# Altium schematic sheet top.SchDoc: RadFET Calibration Stand Top Level
size A2; Author: Michał Gumiela
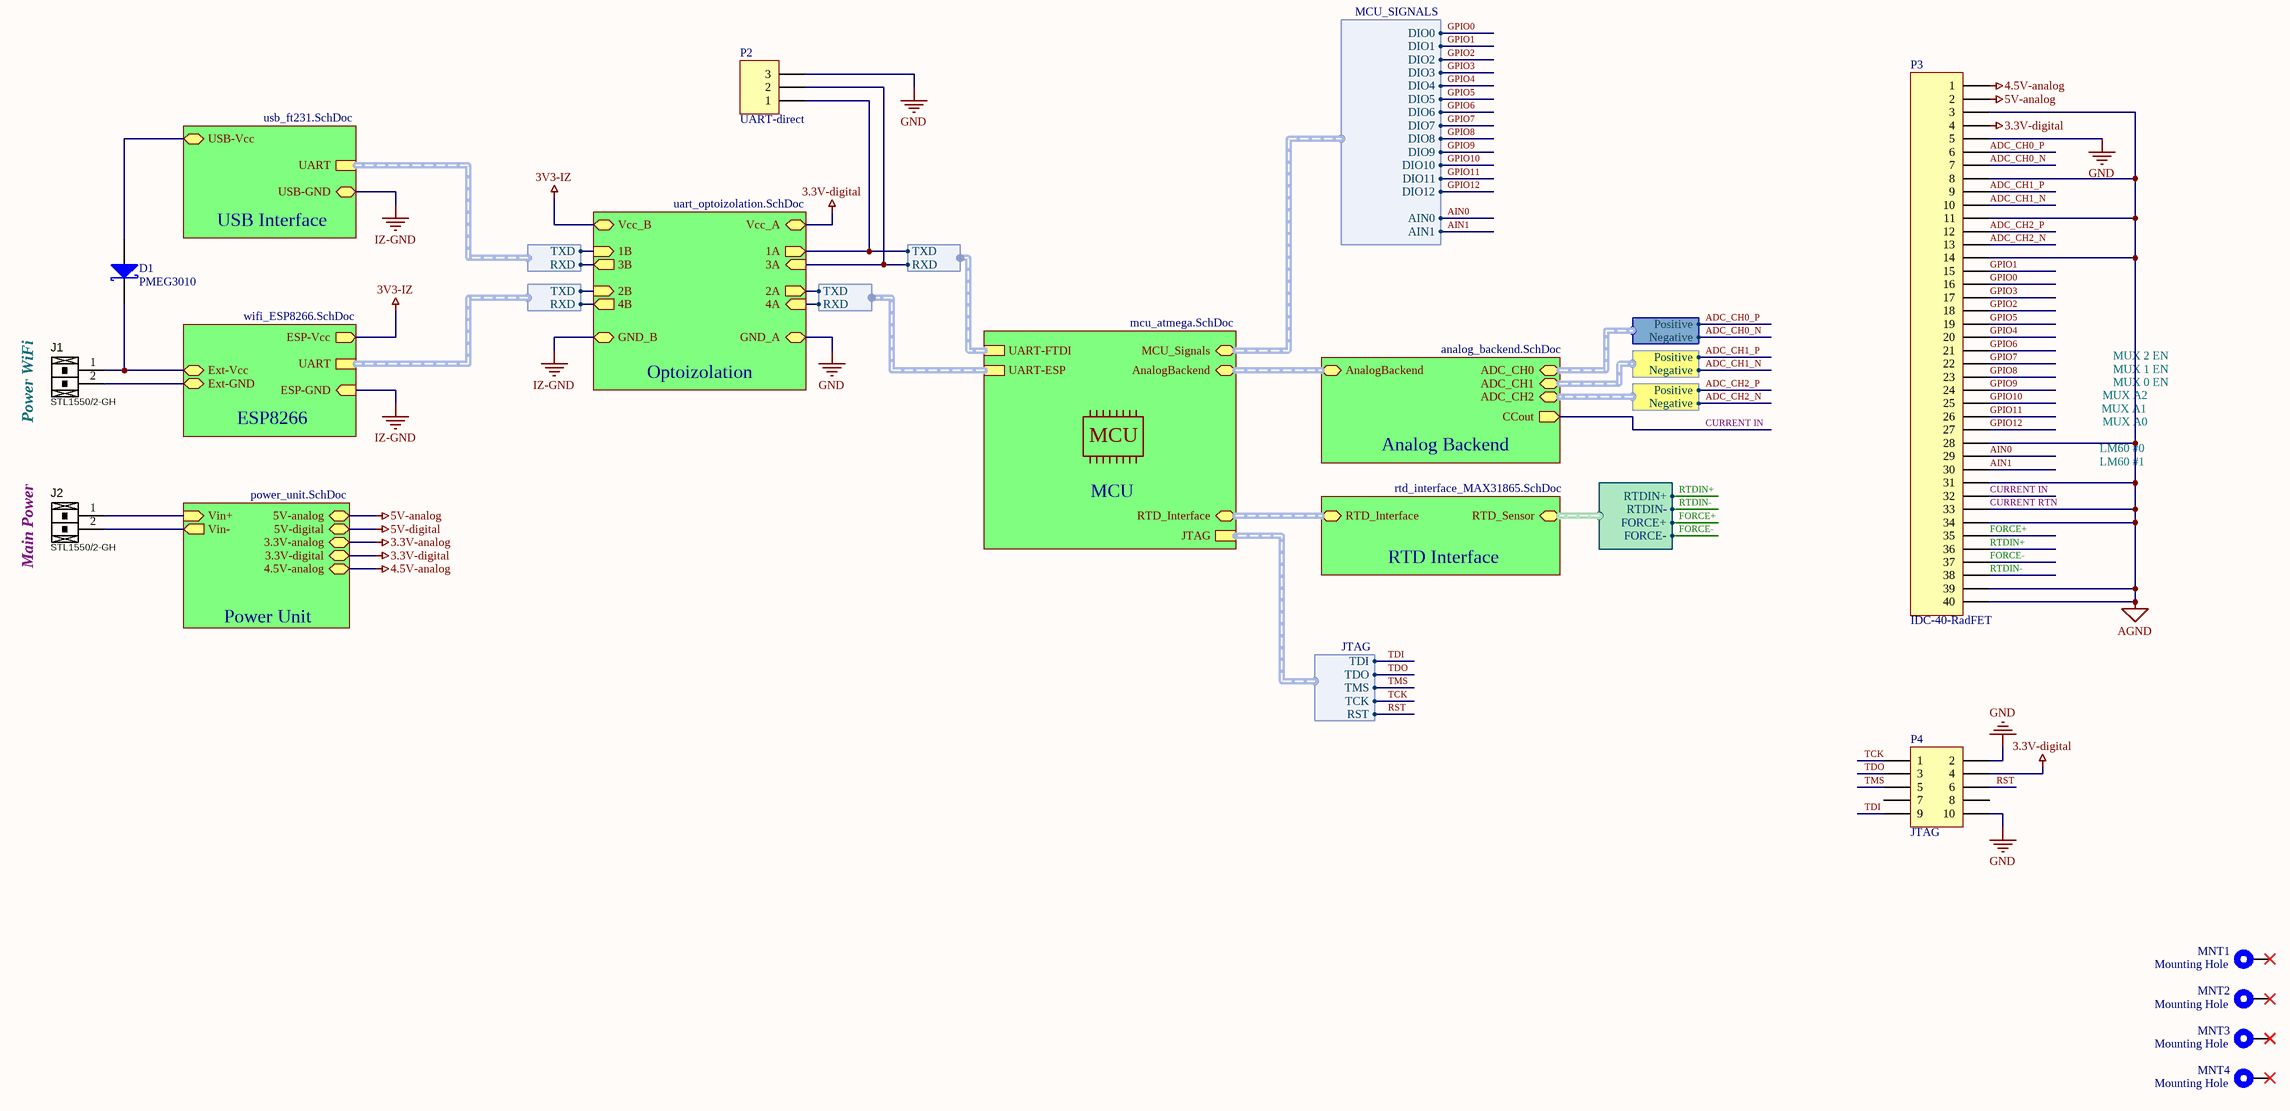
[diagram p0: top.SchDoc]

## Parts
D1  PMEG3010  [SOD-323]
J1  Manufacturer Part Number 1: STL1550/2-GH  [2P_PCB_TERM_BLOCK_HDR_RA]  (hidden comment: 2P_TERM_BLOCK_HEADER)
J2  Manufacturer Part Number 1: STL1550/2-GH  [2P_PCB_TERM_BLOCK_HDR_RA]  (hidden comment: 2P_TERM_BLOCK_HEADER)
MNT1  Mounting Hole  [PC-104_PcbMntHole_M3]
MNT2  Mounting Hole  [PC-104_PcbMntHole_M3]
MNT3  Mounting Hole  [PC-104_PcbMntHole_M3]
MNT4  Mounting Hole  [PC-104_PcbMntHole_M3]
P2  UART-direct  [HEADER 1X3 MALE]
P3  IDC-40-RadFET  [IDC-40-Male-Socket]
P4  JTAG  [IDC-10-Male-Socket]

## Sub-sheets
Analog Backend = analog_backend.SchDoc: ADC_CH0 (harness ADC Channel), ADC_CH1 (harness ADC Channel), ADC_CH2 (harness ADC Channel), AnalogBackend (harness Analog Backend), CCout (out)
ESP8266 = wifi_ESP8266.SchDoc: UART (harness UART), ESP-Vcc (out), ESP-GND (in), Ext-Vcc, Ext-GND
MCU = mcu_atmega.SchDoc: AnalogBackend (harness Analog Backend), UART-FTDI (harness UART), UART-ESP (harness UART), RTD_Interface (harness RTD_DIGITAL), JTAG (harness JTAG), MCU_Signals (harness MCU_SIGNALS)
Optoizolation = uart_optoizolation.SchDoc: Vcc_B, Vcc_A, GND_A, 1A (out), 1B (in), 2B (in), 2A (out), 3A (in), 3B (out), 4B (out), 4A (in), GND_B
Power Unit = power_unit.SchDoc: Vin+ (in), Vin- (out), 5V-analog, 5V-digital, 3.3V-analog, 3.3V-digital, 4.5V-analog
RTD Interface = rtd_interface_MAX31865.SchDoc: RTD_Interface (harness RTD_DIGITAL), RTD_Sensor (harness RTD_SENSOR)
USB Interface = usb_ft231.SchDoc: UART (harness UART), USB-GND, USB-Vcc

## Harnesses
RTD_SENSOR: RTDIN+, RTDIN-, FORCE+, FORCE-
ADC Channel: Positive, Negative
JTAG: TCK, TMS, TDO, TDI, RST
MCU_SIGNALS: DIO0, AIN0, AIN1, DIO1, DIO2, DIO3, DIO4, DIO5, DIO6, DIO7, DIO8, DIO9, DIO10, DIO11, DIO12
UART: RXD, TXD

## Nets
3.3V-analog: sheet Power Unit/3.3V-analog
3.3V-digital: P3.4 P4.4 ; sheet Power Unit/3.3V-digital, sheet Optoizolation/Vcc_A
3V3-IZ: sheet ESP8266/ESP-Vcc, sheet Optoizolation/Vcc_B
4.5V-analog: P3.1 ; sheet Power Unit/4.5V-analog
5V-analog: P3.2 ; sheet Power Unit/5V-analog
5V-digital: sheet Power Unit/5V-digital
CURRENT RTN: P3.3 P3.8 P3.11 P3.14 P3.28 P3.31 P3.33 P3.34 P3.39 P3.40  [also labelled AGND]
GND: P2.3 P3.5 P4.2 P4.10 ; sheet Optoizolation/GND_A
IZ-GND: sheet USB Interface/USB-GND, sheet ESP8266/ESP-GND, sheet Optoizolation/GND_B
ADC_CH0_N: P3.7 ; sheet Analog Backend/ADC_CH0.Negative
ADC_CH0_P: P3.6 ; sheet Analog Backend/ADC_CH0.Positive
ADC_CH1_N: P3.10 ; sheet Analog Backend/ADC_CH1.Negative
ADC_CH1_P: P3.9 ; sheet Analog Backend/ADC_CH1.Positive
ADC_CH2_N: P3.13 ; sheet Analog Backend/ADC_CH2.Negative
ADC_CH2_P: P3.12 ; sheet Analog Backend/ADC_CH2.Positive
AIN0: P3.29 ; sheet MCU/MCU_Signals.AIN0
AIN1: P3.30 ; sheet MCU/MCU_Signals.AIN1
CURRENT IN: P3.32 ; sheet Analog Backend/CCout
FORCE+: P3.35 ; sheet RTD Interface/RTD_Sensor.FORCE+
FORCE-: P3.37 ; sheet RTD Interface/RTD_Sensor.FORCE-
GPIO0: P3.16 ; sheet MCU/MCU_Signals.DIO0
GPIO1: P3.15 ; sheet MCU/MCU_Signals.DIO1
GPIO2: P3.18 ; sheet MCU/MCU_Signals.DIO2
GPIO3: P3.17 ; sheet MCU/MCU_Signals.DIO3
GPIO4: P3.20 ; sheet MCU/MCU_Signals.DIO4
GPIO5: P3.19 ; sheet MCU/MCU_Signals.DIO5
GPIO6: P3.21 ; sheet MCU/MCU_Signals.DIO6
GPIO7: P3.22 ; sheet MCU/MCU_Signals.DIO7
GPIO8: P3.23 ; sheet MCU/MCU_Signals.DIO8
GPIO9: P3.24 ; sheet MCU/MCU_Signals.DIO9
GPIO10: P3.25 ; sheet MCU/MCU_Signals.DIO10
GPIO11: P3.26 ; sheet MCU/MCU_Signals.DIO11
GPIO12: P3.27 ; sheet MCU/MCU_Signals.DIO12
RST: P4.6 ; sheet MCU/JTAG.RST
RTDIN+: P3.36 ; sheet RTD Interface/RTD_Sensor.RTDIN+
RTDIN-: P3.38 ; sheet RTD Interface/RTD_Sensor.RTDIN-
TCK: P4.1 ; sheet MCU/JTAG.TCK
TDI: P4.9 ; sheet MCU/JTAG.TDI
TDO: P4.3 ; sheet MCU/JTAG.TDO
TMS: P4.5 ; sheet MCU/JTAG.TMS
NetD1_1: D1.1(A) ; sheet USB Interface/USB-Vcc
NetD1_2: D1.2(K) J1.1 ; sheet ESP8266/Ext-Vcc
NetJ1_2: J1.2 ; sheet ESP8266/Ext-GND
NetJ2_1: J2.1 ; sheet Power Unit/Vin+
NetJ2_2: J2.2 ; sheet Power Unit/Vin-
NetP2_1: P2.1 ; sheet Optoizolation/1A, sheet MCU/UART-FTDI.TXD
NetP2_2: P2.2 ; sheet Optoizolation/3A, sheet MCU/UART-FTDI.RXD
(unnamed): sheet Optoizolation/1B, sheet USB Interface/UART.TXD
(unnamed): sheet Optoizolation/2B, sheet ESP8266/UART.TXD
(unnamed): sheet Optoizolation/2A, sheet MCU/UART-ESP.TXD
(unnamed): sheet Optoizolation/3B, sheet USB Interface/UART.RXD
(unnamed): sheet Optoizolation/4B, sheet ESP8266/UART.RXD
(unnamed): sheet Optoizolation/4A, sheet MCU/UART-ESP.RXD

Not connected (* = marked no-connect by the designer): MNT1 1*; MNT2 1*; MNT3 1*; MNT4 1*; P4 7 8

## Buses and harness runs
harness sheet Analog Backend/AnalogBackend = sheet MCU/AnalogBackend
harness sheet MCU/RTD_Interface = sheet RTD Interface/RTD_Interface

## Notes on the sheet
- MUX A2
- MUX 2 EN
- MUX 1 EN
- MUX 0 EN
- (near J1) Power WiFi
- MCU
- LM60 #0
- MUX A1
- MUX A0
- LM60 #1
- (near J2) Main Power
- Title:
- Sheet:
- of
- Author:
- Model:
- File name:
- Document Number:
- Checked by:
- Iss-Rev:
- Approved by:
- Date:

## Library data of the parts
D1 = SchottkyX: Schottky Rectifier
J1 J2 = 2P_TERM_BLOCK_HEADER: Terminal Block THT 2-position header 3.81mm pitch; Pitch: 3.5 mm; Package / Case: Header; 3.5mm pitch; Supplier 1: Piekarz; Supplier Part Number 1: 00601; Supplier Part URL: http://www.piekarz.pl/pl/?item=1235
MNT1-MNT4 = MntHole: PCB Mounting Hole; Value: Mounting Hole
P2 = Header 3: Header, 3-Pin; LatestRevisionDate: 17-Jul-2002; LatestRevisionNote: Re-released for DXP Platform.; Publisher: Altium Limited
P4 = Header 5X2: Header, 5-Pin, Dual row
P3 = IDC-40-RadFET: LatestRevisionDate: 17-Jul-2002; LatestRevisionNote: Re-released for DXP Platform.; Publisher: Altium Limited